# Altium schematic sheet ControlBoard.SchDoc
size A4
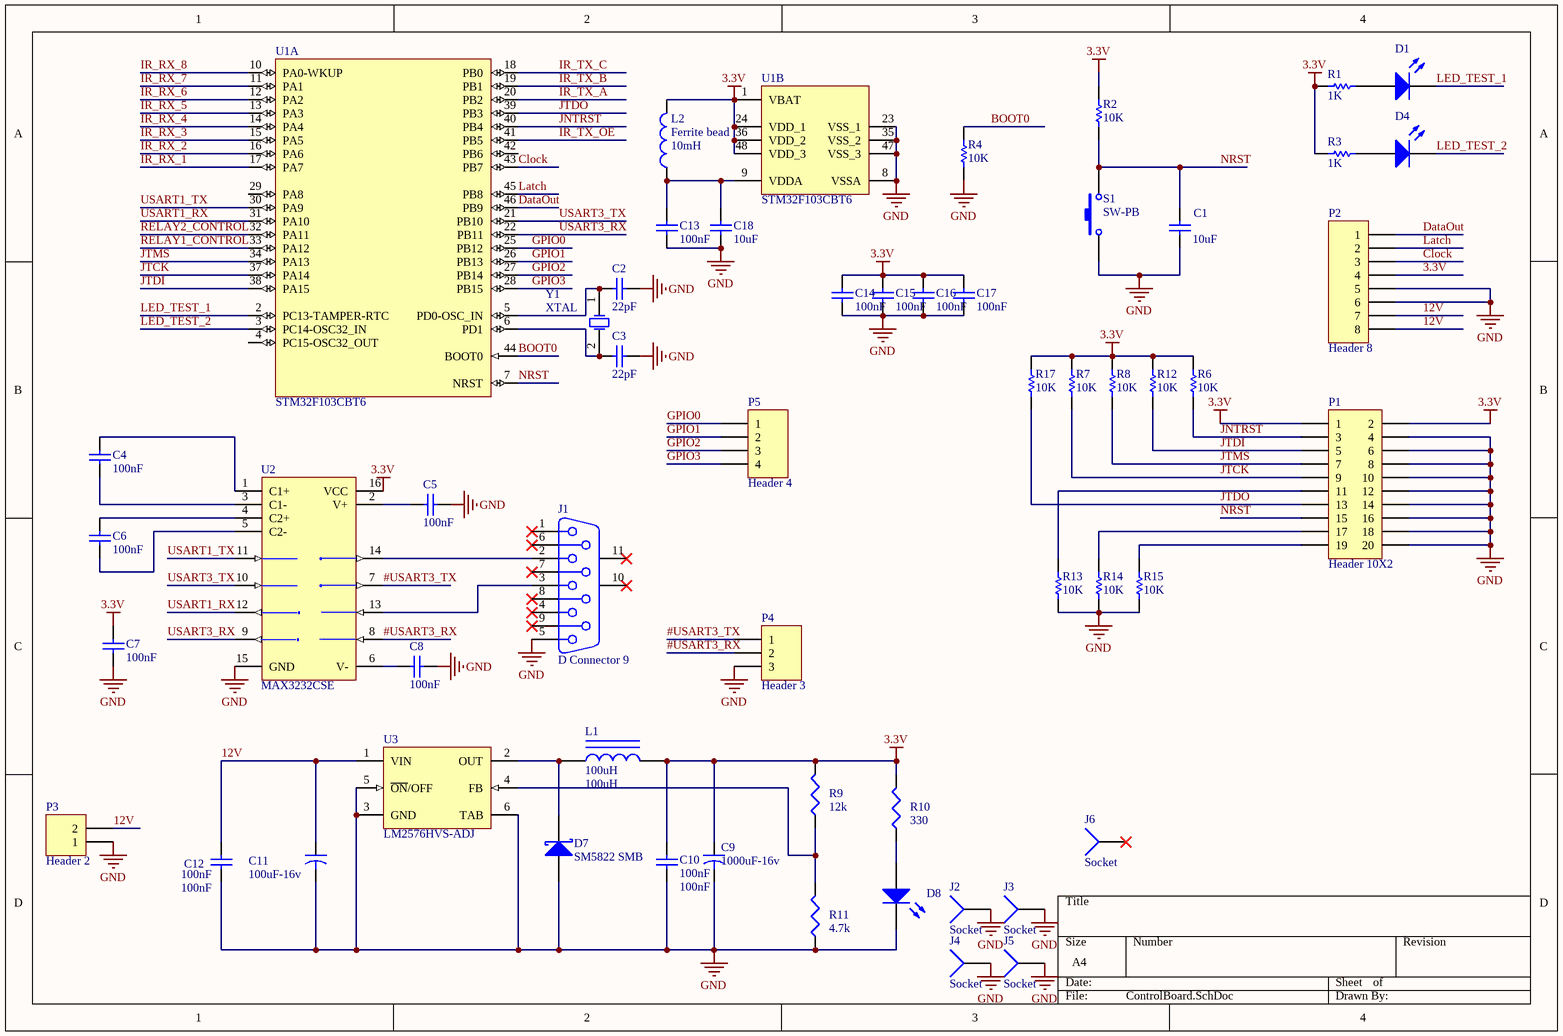
[diagram p0: ControlBoard.SchDoc]

## Parts
C1  10uF  [0805]
C2  22pF  [0805]
C3  22pF  [0805]
C4  100nF  [0805]
C5  100nF  [0805]
C6  100nF  [0805]
C7  100nF  [0805]
C8  100nF  [0805]
C9  1000uF-16v  [CAP-SMD]
C10  100nF  [0805]
C11  100uF-16v  [2817P]
C12  100nF  [0805]
C13  100nF  [0805]
C14  100nF  [0805]
C15  100nF  [0805]
C16  100nF  [0805]
C17  100nF  [0805]
C18  10uF  [0805]
D1  LED  [LED-0805-RED]  (value not drawn)
D4  LED  [LED-0805-RED]  (value not drawn)
D7  SM5822 SMB  [SMB]
D8  LED  [LED-0805-RED]  (value not drawn)
J1  D Connector 9  [DSUB1.385-2H9]
J2  Socket  [Board Screw_No Silk]
J3  Socket  [Board Screw_No Silk]
J4  Socket  [Board Screw_No Silk]
J5  Socket  [Board Screw_No Silk]
J6  Socket  [Logo]
L1  100uH  [IND_SMD12X12]
L2  Ferrite bead  value 10mH  [0805]
P1  Header 10X2  [IDC20-I]
P2  Header 8  [HDR1X8]
P3  Header 2  [Terminal 1*2]
P4  Header 3  [HDR1X3]
P5  Header 4  [HDR1X4]
R1  1K  [0805]
R2  10K  [0805]
R3  1K  [0805]
R4  10K  [0805]
R6  10K  [0805]
R7  10K  [0805]
R8  10K  [0805]
R9  12k  [0805]
R10  330  [0805]
R11  4.7k  [0805]
R12  10K  [0805]
R13  10K  [0805]
R14  10K  [0805]
R15  10K  [0805]
R17  10K  [0805]
S1  SW-PB  [TUCHSWITCH_SMD_2]
U1  STM32F103CBT6  [LQFP48_N]  (parts A,B of 2)
U2  MAX3232CSE  [NSO16_N]
U3  LM2576HVS-ADJ  [TS5B_N]
Y1  XTAL  [XTAL]

## Nets
3.3V: C7.1 C9.1 C10.2 C14.1 C15.1 C16.1 C17.1 L1.2 L2.2 P1.1 P1.2 P2.4 R1.1 R2.1 R3.1 R6.1 R7.1 R8.1 R9.2 R10.2 R12.1 R17.1 U1.1(VBAT) U1.24(VDD_1) U1.36(VDD_2) U1.48(VDD_3) U2.16(VCC)
GND: C1.1 C2.1 C3.1 C5.2 C7.2 C8.2 C9.2 C10.1 C11.1 C12.1 C13.2 C14.2 C15.2 C16.2 C17.2 C18.2 D7.1(A) D8.2(K) J1.5 J2.1 J3.1 J4.1 J5.1 P1.4 P1.6 P1.8 P1.10 P1.12 P1.14 P1.16 P1.18 P1.20 P2.5 P2.6 P3.1 P4.3 R4.2 R11.1 R13.2 R14.2 R15.2 S1.1 U1.8(VSSA) U1.23(VSS_1) U1.35(VSS_2) U1.47(VSS_3) U2.15(GND) U3.3(GND) U3.5(~{ON}/OFF) U3.6(TAB)
12V: C11.2 C12.2 P2.7 P2.8 P3.2 U3.1(VIN)
#USART3_RX: P4.2 U2.8(R2IN)
#USART3_TX: P4.1 U2.7(T2OUT)
BOOT0: R4.1 U1.44(BOOT0)
Clock: P2.3 U1.43(PB7)
DataOut: P2.1 U1.46(PB9)
GPIO0: P5.1 U1.25(PB12)
GPIO1: P5.2 U1.26(PB13)
GPIO2: P5.3 U1.27(PB14)
GPIO3: P5.4 U1.28(PB15)
IR_RX_1: U1.17(PA7)
IR_RX_2: U1.16(PA6)
IR_RX_3: U1.15(PA5)
IR_RX_4: U1.14(PA4)
IR_RX_5: U1.13(PA3)
IR_RX_6: U1.12(PA2)
IR_RX_7: U1.11(PA1)
IR_RX_8: U1.10(PA0-WKUP)
IR_TX_A: U1.20(PB2)
IR_TX_B: U1.19(PB1)
IR_TX_C: U1.18(PB0)
IR_TX_OE: U1.41(PB5)
JNTRST: P1.3 R6.2 U1.40(PB4)
JTCK: P1.9 R7.2 U1.37(PA14)
JTDI: P1.5 R12.2 U1.38(PA15)
JTDO: P1.13 R17.2 U1.39(PB3)
JTMS: P1.7 R8.2 U1.34(PA13)
Latch: P2.2 U1.45(PB8)
LED_TEST_1: D1.2(K) U1.2(PC13-TAMPER-RTC)
LED_TEST_2: D4.2(K) U1.3(PC14-OSC32_IN)
NRST: C1.2 P1.15 R2.2 S1.2 U1.7(NRST)
RELAY1_CONTROL: U1.33(PA12)
RELAY2_CONTROL: U1.32(PA11)
USART1_RX: U1.31(PA10) U2.12(R1OUT)
USART1_TX: U1.30(PA9) U2.11(T1IN)
USART3_RX: U1.22(PB11) U2.9(R2OUT)
USART3_TX: U1.21(PB10) U2.10(T2IN)
NetC2_2: C2.2 U1.5(PD0-OSC_IN) Y1.1(OSC1)
NetC3_2: C3.2 U1.6(PD1) Y1.2(OSC2)
NetC4_1: C4.1 U2.1(C1+)
NetC4_2: C4.2 U2.3(C1-)
NetC5_1: C5.1 U2.2(V+)
NetC6_1: C6.1 U2.4(C2+)
NetC6_2: C6.2 U2.5(C2-)
NetC8_1: C8.1 U2.6(V-)
NetC13_1: C13.1 C18.1 L2.1 U1.9(VDDA)
NetD1_1: D1.1(A) R1.2
NetD4_1: D4.1(A) R3.2
NetD7_2: D7.2(K) L1.1 U3.2(OUT)
NetD8_1: D8.1(A) R10.1
NetJ1_2: J1.2 U2.14(T1OUT)
NetJ1_3: J1.3 U2.13(R1IN)
NetP1_11: P1.11 R13.1
NetP1_17: P1.17 R14.1
NetP1_19: P1.19 R15.1
NetR9_1: R9.1 R11.2 U3.4(FB)

Not connected (* = marked no-connect by the designer): J1 1* 4* 6* 7* 8* 9* 10(MH1)* 11(MH2)*; J6 1*; U1 4(PC15-OSC32_OUT) 29(PA8) 42(PB6)

## Library data of the parts
C1 = VP32BY104: Dipped Radial Multilayer Ceramic Capacitor X7R: 100nF; Note: See Datasheet for other packages & tolerances; Published: 17-Dec-2003; DatasheetDocument: 4-Feb-2002; PackageDocument: 4-Feb-2002; PackageReference: VP32-2.5; Publisher: Altium Limited; ComponentLink1Description: Manufacturer Link; ComponentLink1URL: http://www.vishay.com/; Value: 10uF
C2-C8 C10 C12-C18 = Cap: Capacitor; Published: 8-Jun-2000; LatestRevisionDate: 17-Jul-2002; LatestRevisionNote: Re-released for DXP Platform.; PackageReference: RAD-0.3; Publisher: Altium Limited; PackageDescription: Radial Cap, Thru-Hole; 2 Leads; 0.3 in Pin Spacing
  C2 C3: Value: 22pF
  C4-C8 C10 C12-C17: Value: 100nF
  C18: Value: 10uF
C9 = Cap2: Aluminium Electrolytic Capacitor-SMD; Published: 23-Sep-2002; PackageReference: CAPR5-4X5; Publisher: Altium Limited; PackageDescription: Capacitor; 2 Leads; Value: 1000uF-16v
C11 = Cap2: Tantalum Chip Capacitor-SMD; Published: 23-Sep-2002; PackageReference: CAPR5-4X5; Publisher: Altium Limited; PackageDescription: Capacitor; 2 Leads; Value: 100uF-16v
D1 D4 = LED0: Typical INFRARED GaAs LED; Published: 8-Jun-2000; LatestRevisionDate: 08-Jul-2005; LatestRevisionNote: Mech Layer 1 removed.; PackageReference: LED-0; Publisher: Altium Limited; PackageDescription: LED; 2 Leads
D7 = Diode 1N5822: Silicon AF Schottky Diode for High-Speed Switching; Note: Pin 2 is not connected and not drawn.; Published: 21-Mar-2003; LatestRevisionDate: 29-May-2009; LatestRevisionNote: IPC-7351 Footprint Added.; DatasheetVersion: Oct-1999; PackageVersion: Sep-2001; PackageReference: SOT-23; Publisher: Altium Limited; PackageDescription: 3-Pin SOT-23 Package 0.95 mm Pitch, 2.5 mm Lead Span; ComponentLink1Description: Manufacturer Link; ComponentLink1URL: http://www.infineon.com/; ComponentLink2Description: Datasheet; ComponentLink2URL: http://www.infineon.com/upload/Document/cmc_upload/documents/009/382/bas40_bas140series_1.pdf
D8 = LED2: Typical RED, GREEN, YELLOW, AMBER GaAs LED; Published: 8-Jun-2000; LatestRevisionDate: 17-Jul-2002; LatestRevisionNote: Re-released for DXP Platform.; PackageVersion: Feb-2002; PackageReference: 3.2X1.6X1.1; Publisher: Altium Limited; PackageDescription: SM LED; 2 Flat Leads
J1 = D Connector 9: Receptacle Assembly, 9 Position, Right Angle; PackageDocument: O; Positions: 9; Published: 15-Jun-2001; LatestRevisionDate: 17-Jul-2002; LatestRevisionNote: Re-released for DXP Platform.; DatasheetDocument: 1-Sep-1999; PackageReference: 788750; Publisher: Altium Limited; Orientation: Right Angle; Gender: Receptacle
L1 = Inductor Iron: Magnetic-Core Inductor; Published: 24-Mar-1999; LatestRevisionDate: 17-Jul-2002; LatestRevisionNote: Re-released for DXP Platform.; PackageReference: AXIAL-0.9; Publisher: Altium Limited; PackageDescription: Axial Device, Thru-Hole; 2 Leads; 0.9 in Pin Spacing; Value: 100uH
L2 = Inductor: Code_IEC: 1005; Published: 8-Jun-2000; LatestRevisionDate: 29-May-2009; LatestRevisionNote: IPC-7351 Footprint Added.; PackageReference: 0402-A; Publisher: Altium Limited; PackageDescription: Chip Inductor; Code_JEITA: 0402
P1 = Header 10X2: Header, 10-Pin, Dual row; LatestRevisionDate: 17-Jul-2002; LatestRevisionNote: Re-released for DXP Platform.; Publisher: Altium Limited
P2 = Header 8: Header, 8-Pin; LatestRevisionDate: 17-Jul-2002; LatestRevisionNote: Re-released for DXP Platform.; Publisher: Altium Limited
P3 = Header 2: Header, 2-Pin; LatestRevisionDate: 17-Jul-2002; LatestRevisionNote: Re-released for DXP Platform.; Publisher: Altium Limited
P4 = Header 3: Header, 3-Pin; LatestRevisionDate: 17-Jul-2002; LatestRevisionNote: Re-released for DXP Platform.; Publisher: Altium Limited
P5 = Header 4: Header, 4-Pin; LatestRevisionDate: 17-Jul-2002; LatestRevisionNote: Re-released for DXP Platform.; Publisher: Altium Limited
R1-R4 R6-R8 R12-R15 R17 = Res1: Resistor; Published: 8-Jun-2000; LatestRevisionDate: 17-Jul-2002; LatestRevisionNote: Re-released for DXP Platform.; PackageReference: AXIAL-0.3; Publisher: Altium Limited; PackageDescription: Axial Device, Thru-Hole; 2 Leads; 0.3 in Pin Spacing
  R1 R3: Value: 1K
  R2 R4 R6-R8 R12-R15 R17: Value: 10K
R9-R11 = Res3: Resistor; Published: 8-Jun-2000; LatestRevisionDate: 29-May-2009; LatestRevisionNote: IPC-7351 Footprint Added.; PackageReference: J1-0603; Publisher: Altium Limited; PackageDescription: Chip Resistor
  R9: Value: 12k
  R10: Value: 330
  R11: Value: 4.7k
S1 = SW-PB: Switch; Published: 24-Mar-1999; LatestRevisionDate: 17-Jul-2002; LatestRevisionNote: Re-released for DXP Platform.; PackageReference: SPST-2; Publisher: Altium Limited; PackageDescription: Switch; 2 Leads
U1 = STM32F103CBT6: STM32 ARM-based 32-bit MCU Performance Line with 128 kB Flash, 20 kB Internal RAM, -40 to +85°C Temperature, 48-Pin LQFP, Tray; DatasheetVersion: rev13.0, Apr-2011; PackageVersion: rev13, Apr-2011; PackageReference: LQFP48; PackageDescription: 48-Pin Low-Profile Quad Flat Pack, 7 x 7 mm Body, 0.5 mm Pitch (LQFP48); ComponentLink1Description: Manufacturer URL; ComponentLink1URL: http://www.st.com/; ComponentLink2Description: STM32F103 Datasheet; ComponentLink2URL: http://www.st.com/internet/com/TECHNICAL_RESOURCES/TECHNICAL_LITERATURE/DATASHEET/CD00161566.pdf; ComponentLink3Description: STM32 Family Web Page; ComponentLink3URL: www.st.com/stm32
U2 = MAX3232CSE: 3.0V TO 5.5V, Low-Power, up to 1Mbps, True RS-232 Transceiver Using Four 0.1µF External Capacitor; Published: 16-Jan-2001; LatestRevisionDate: 13-Apr-2006; LatestRevisionNote: IPC-7351 Footprint Added.; DatasheetVersion: Mar-1999; PackageReference: NSO16; Publisher: Altium Limited; PackageDescription: 16-Pin Small Outline Integrated Circuit 1.27 mm Pitch; Code_JEDEC: MS-012-AC; Code_IPC: SOIC127P600-16; ComponentLink1Description: Manufacturer Link; ComponentLink1URL: http://www.maxim-ic.com/; ComponentLink2Description: Datasheet; ComponentLink2URL: http://pdfserv.maxim-ic.com/en/ds/MAX3222-MAX3241.pdf
U3 = LM2576HVS-ADJ: SIMPLE SWITCHER® 3A Step-Down Voltage Regulator, 5-pin TO-263; Manufacturer: National Semiconductor; PackageTopMarking: NSUZXYTTE#*LM2576*HVS-ADJ P+; PowerWise: N; High-Reliability: Y; DatasheetVersion: Aug-2004; PackageVersion: revD, Apr-2005; PackageReference: TS5B; PackageDescription: TO-263, Molded, .400 x .390 x .180in, 5 Lead, .067in Pitch, Surface Mount; PartNumber: LM2576HVS-ADJ; RoHS: N; PinCount: 5; CompType: Switcher; Code_JEDEC: MO-169-AB; ComponentLink1Description: Manufacturer URL; ComponentLink1URL: http://www.national.com/; ComponentLink2Description: LM2576HV Datasheet; ComponentLink2URL: http://www.national.com/ds/LM/LM2576HV.pdf; ComponentLink3Description: LM2576HV Web Page; ComponentLink3URL: http://www.national.com/pf/LM/LM2576HV.html; ComponentLink4Description: TS5B Package Page; ComponentLink4URL: http://www.national.com/packaging/folders/ts5b.html
Y1 = XTAL: Crystal Oscillator; Published: 8-Jun-2000; LatestRevisionDate: 17-Jul-2002; LatestRevisionNote: Re-released for DXP Platform.; PackageReference: R38; Publisher: Altium Limited; PackageDescription: Crystal, Thru-Hole; 2 Leads; Body 3.1 x 8.2 mm (Dia.xH)
J2-J6 = Socket: LatestRevisionDate: 17-Jul-2002; LatestRevisionNote: Re-released for DXP Platform.; Publisher: Altium Limited